# EAGLE design rs232_adapter (EAGLE 6.2)
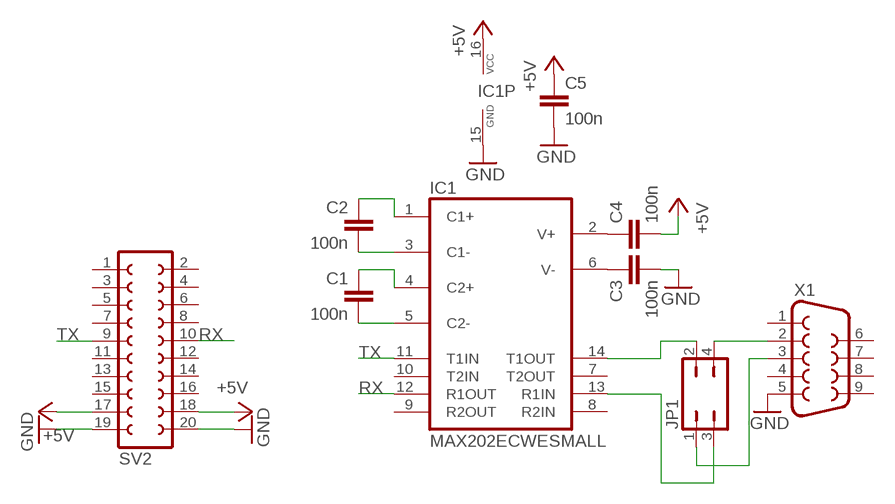
[diagram p0: schematic, sheet 1]

## Parts
C1  100n  C-EUC0805  [C0805]
C2  100n  C-EUC0805  [C0805]
C3  100n  C-EUC0805  [C0805]
C4  100n  C-EUC0805  [C0805]
C5  100n  C-EUC0805  [C0805]
IC1  MAX202ECWESMALL  [SO16]
JP1  JP2Q  [JP2Q]
SV2  FE10-2  [FE10-2]
X1  F09HP  [F09HP]

## Nets
+5V: C4.2 C5.1 IC1.16(VCC) SV2.17 SV2.18
GND: C3.2 C5.2 IC1.15(GND) SV2.19 SV2.20 X1.5
N$1: C1.2 IC1.5(C2-)
N$2: C1.1 IC1.4(C2+)
N$3: C2.2 IC1.3(C1-)
N$4: C2.1 IC1.1(C1+)
N$5: C3.1 IC1.6(V-)
N$6: C4.1 IC1.2(V+)
N$7: IC1.14(T1OUT) JP1.2
N$8: IC1.13(R1IN) JP1.3
N$9: JP1.4 X1.2
N$10: JP1.1 X1.3
RX: IC1.12(R1OUT) SV2.10
TX: IC1.11(T1IN) SV2.9
Unconnected: IC1.7(T2OUT) IC1.8(R2IN) IC1.9(R2OUT) IC1.10(T2IN) SV2.1 SV2.2 SV2.3 SV2.4 SV2.5 SV2.6 SV2.7 SV2.8 SV2.11 SV2.12 SV2.13 SV2.14 SV2.15 SV2.16 X1.1 X1.4 X1.6 X1.7 X1.8 X1.9

## Library data of the parts
C1-C5 = rcl:C-EU: CAPACITOR, European symbol
IC1 = maxim:MAX202ECWE: RS232 TRANSEIVER
JP1 = jumper:JP2Q: JUMPER
SV2 = con-lsta:FE10-2: FEMALE HEADER; OC_FARNELL: unknown; OC_NEWARK: unknown
X1 = con-subd:F09: SUB-D; OC_FARNELL: unknown; OC_NEWARK: unknown

## Board
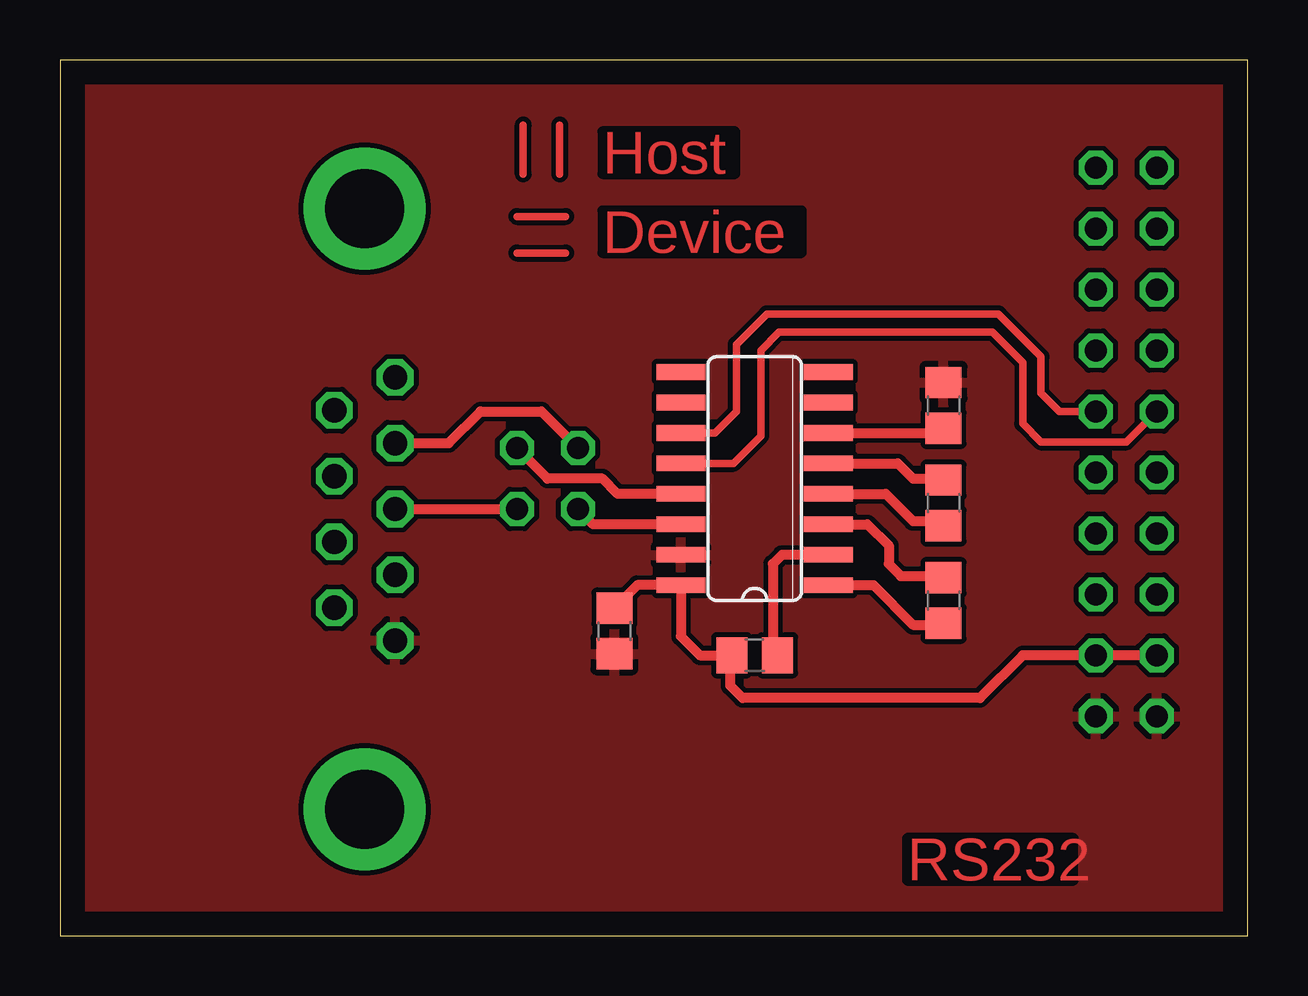
[diagram p1: board, top side]
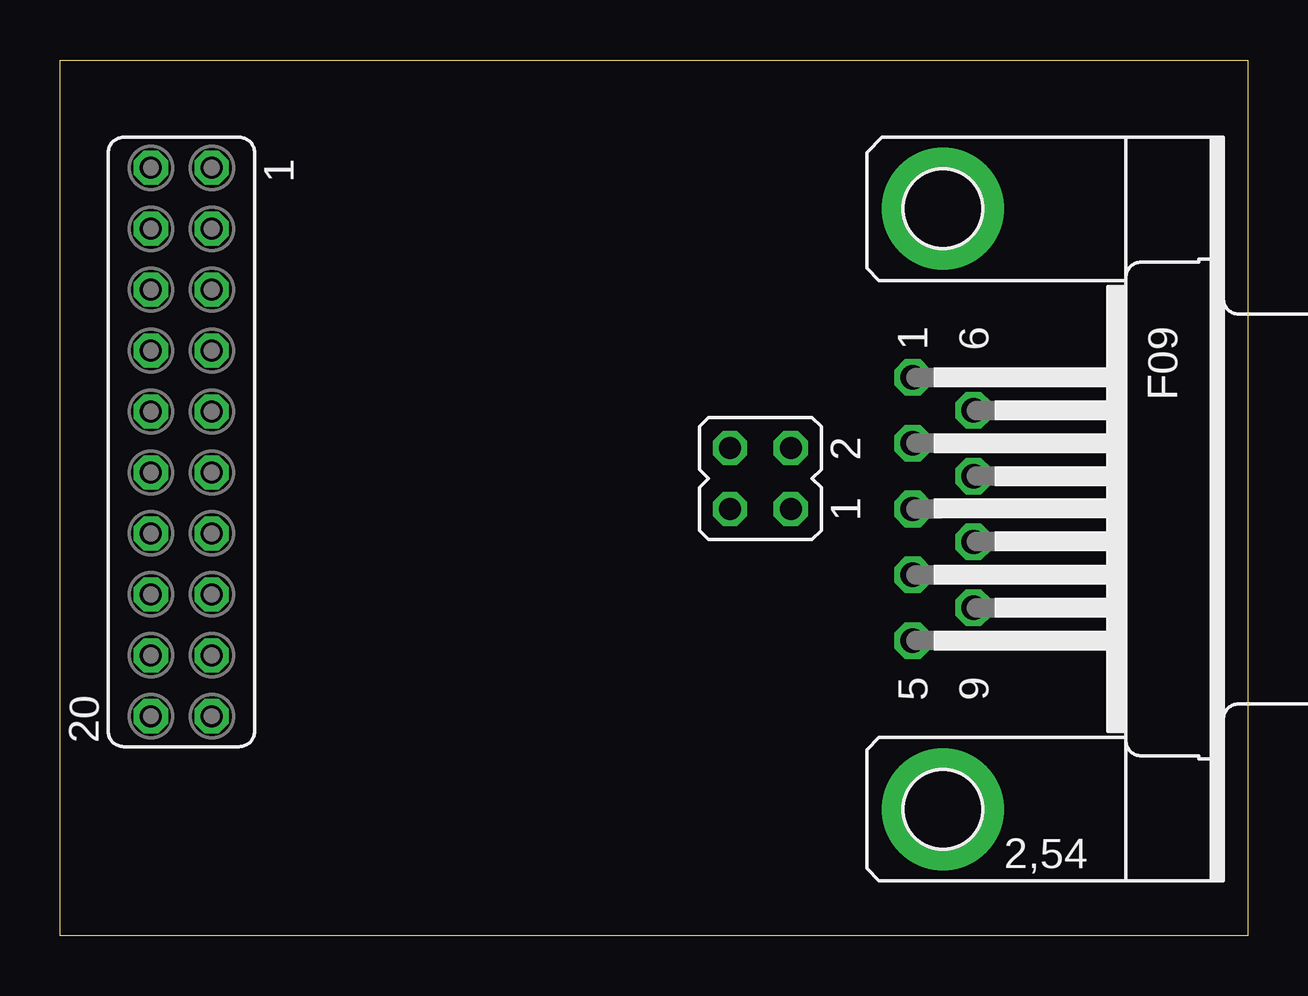
[diagram p2: board, bottom side, seen from below]

Size 49.51 x 36.5 mm. Coordinates in mm from the lower left corner, seen from the top.
Outline: 0,0 49.51,0 49.51,36.5 0,36.5 0,0
Copper layers (1*16): Top 0.035mm / dielectric 1.5mm / Bottom 0.035mm
Design rules: minimum track width 10mil, minimum drill 24mil, track to track 8mil, track to pad 8mil, pad to pad 8mil, via to via 8mil, smd to smd 8mil, copper to edge 40mil, drill to drill 8mil, minimum pad ring 10mil, minimum via ring 8mil, stop-mask expansion 4mil, vias tented up to drill 0mil, thermal gap 10mil

### Footprints (pad centres in the part's own frame; a part is rotated, then mirrored left to right if it is on the bottom)
C0805 = smd 1.3 x 1.5: 1 -0.95,0; 2 0.95,0
SO16 = smd 0.66 x 2.032: 1 -4.445,-3.073; 2 -3.175,-3.073; 3 -1.905,-3.073; 4 -0.635,-3.073; 5 0.635,-3.073; 6 1.905,-3.073; 7 3.175,-3.073; 8 4.445,-3.073; 9 4.445,3.073; 10 3.175,3.073; 11 1.905,3.073; 12 0.635,3.073; 13 -0.635,3.073; 14 -1.905,3.073; 15 -3.175,3.073; 16 -4.445,3.073
JP2Q = drill 0.914 octagon: 1 -1.27,-1.27; 2 -1.27,1.27; 3 1.27,-1.27; 4 1.27,1.27
FE10-2 = drill 0.914 octagon: 1 -11.43,1.27; 2 -11.43,-1.27; 3 -8.89,1.27; 4 -8.89,-1.27; 5 -6.35,1.27; 6 -6.35,-1.27; 7 -3.81,1.27; 8 -3.81,-1.27; 9 -1.27,1.27; 10 -1.27,-1.27; 11 1.27,1.27; 12 1.27,-1.27; 13 3.81,1.27; 14 3.81,-1.27; 15 6.35,1.27; 16 6.35,-1.27; 17 8.89,1.27; 18 8.89,-1.27; 19 11.43,1.27; 20 11.43,-1.27
F09HP = drill 1.016 octagon: 1 -5.486,-1.27; 2 -2.743,-1.27; 3 0,-1.27; 4 2.743,-1.27; 5 5.486,-1.27; 6 -4.115,1.27; 7 -1.372,1.27; 8 1.372,1.27; 9 4.115,1.27 | drill 3.302 pad 5.08: G1 -12.522,0; G2 12.522,0

### Placement (x,y rotation side)
C1  36.83,18.03 90 top
C2  36.83,13.97 90 top
C3  36.83,22.1 90 top
C4  28.96,11.68 180 top
C5  23.11,12.7 270 top
IC1  28.96,19.05 90 top
JP1  20.32,19.05 90 bottom
SV2  44.45,20.57 270 bottom
X1  12.7,17.78 270 bottom

### Tracks (layer width: path | path; a pad name or v marks a point on that pad's centre or on a via)
+5V
  Top 0.406: C5.1 24.07,14.61 IC1.16 25.88,12.47 26.67,11.68 C4.2 27.94,11.62 27.94,10.41 28.45,9.91 38.35,9.91 40.13,11.68 SV2.17 SV2.18
GND
  pour Top: -1.27,38.1 50.8,38.1 50.8,-1.27 -1.27,-1.27
N$1
  Top 0.406: IC1.5 34.92,19.68 35.56,19.05 36.76,19.05 C1.2
N$2
  Top 0.406: IC1.4 34.42,18.41 35.56,17.27 36.64,17.27 C1.1
N$3
  Top 0.406: IC1.3 33.66,17.14 34.54,16.26 34.54,15.49 35.05,14.99 36.76,14.99 C2.2
N$4
  Top 0.406: IC1.1 33.91,14.61 35.56,12.95 36.76,12.95 C2.1
N$5
  Top 0.406: IC1.6 36.64,20.95 C3.1
N$6
  Top 0.406: IC1.2 30.1,15.88 29.72,15.49 29.72,11.87 C4.1
N$7
  Top 0.406: IC1.14 22.23,17.14 JP1.2
N$8
  Top 0.406: IC1.13 23.24,18.41 22.61,19.05 20.32,19.05 JP1.3
N$9
  Top 0.406: X1.2 16.2,20.52 17.53,21.84 20.07,21.84 JP1.4
N$10
  Top 0.406: X1.3 JP1.1
N$11
  Top 0.305: 19.3,31.75 19.3,33.78
N$12
  Top 0.305: 20.83,33.78 20.83,31.75
N$13
  Top 0.305: 19.05,29.97 21.08,29.97
N$14
  Top 0.305: 19.05,28.45 21.08,28.45
RX
  Top 0.305: IC1.12 28.07,19.68 29.21,20.83 29.21,24.38 29.97,25.15 38.86,25.15 40.13,23.88 40.13,21.34 40.89,20.57 44.45,20.57 SV2.10
TX
  Top 0.305: SV2.9 41.66,21.84 40.89,22.61 40.89,24.13 39.12,25.91 29.46,25.91 28.19,24.64 28.19,21.84 27.3,20.95 IC1.11

### Text on the board
Top: Host | Device | RS232